# EAGLE schematic rld-mobile (EAGLE 9.6.2)

## Sheet 1 of 3: MCU
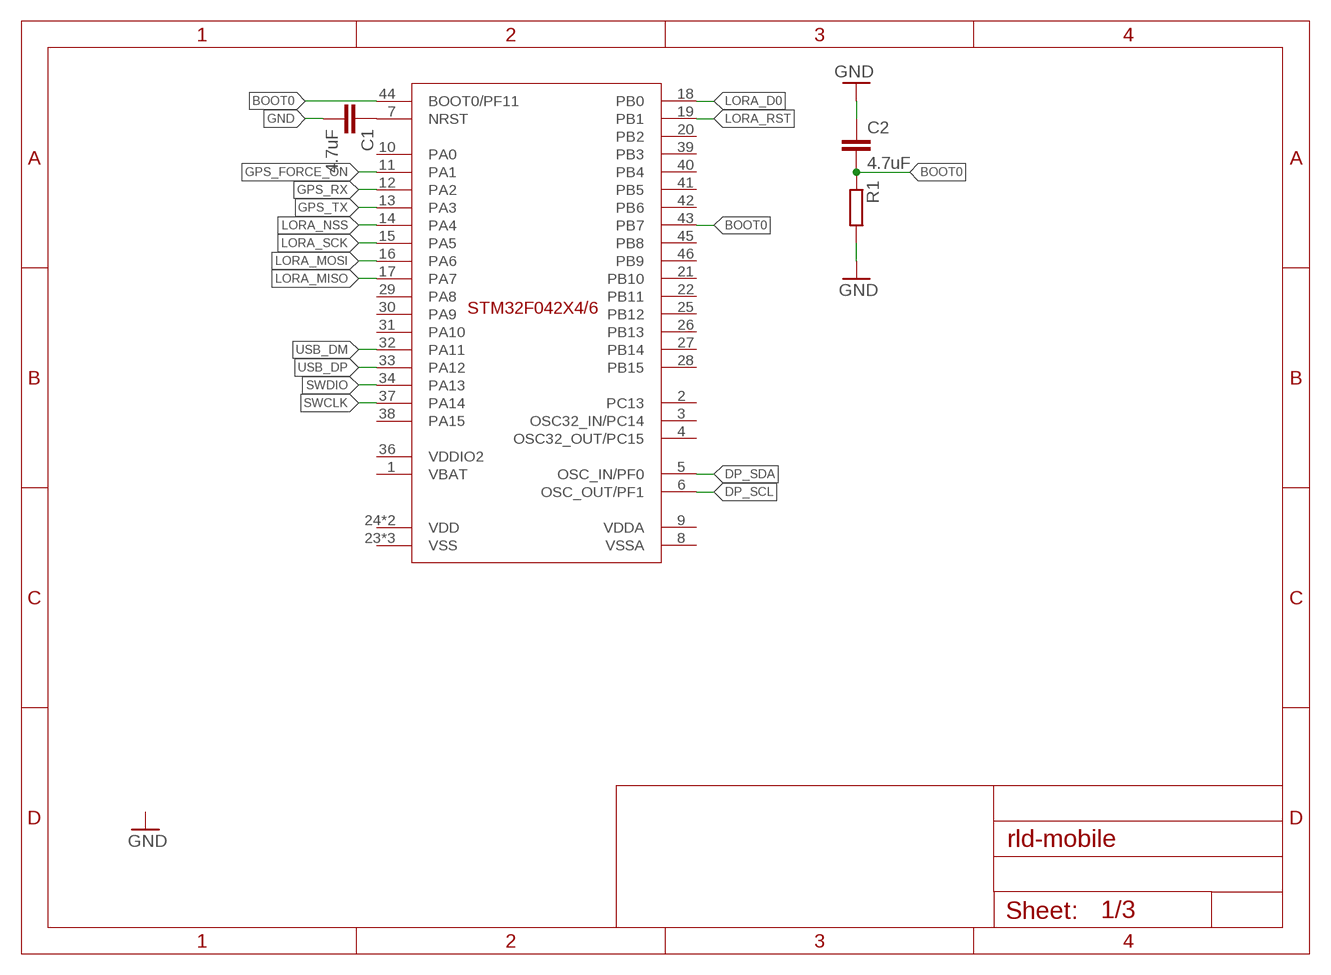
[diagram p0: schematic, sheet 1]

### Parts
C1  4.7uF  C-EUC0805  [C0805]
C2  4.7uF  C-EUC0805  [C0805]
R1  R-EU_R0805  [R0805]
U$1  STM32-F042X4/6-48  [UFQFPN48-7X7]

### Nets
BOOT0: C2.2 R1.1 U$1.43(PB7) U$1.44(BOOT0/PF11)
DP_SCL: U$1.6(OSC_OUT/PF1)
DP_SDA: U$1.5(OSC_IN/PF0)
GND: C1.2 C2.1 R1.2
GPS_FORCE_ON: U$1.11(PA1)
GPS_RX: U$1.12(PA2)
GPS_TX: U$1.13(PA3)
LORA_D0: U$1.18(PB0)
LORA_MISO: U$1.17(PA7)
LORA_MOSI: U$1.16(PA6)
LORA_NSS: U$1.14(PA4)
LORA_RST: U$1.19(PB1)
LORA_SCK: U$1.15(PA5)
N$2: C1.1 U$1.7(NRST)
SWCLK: U$1.37(PA14)
SWDIO: U$1.34(PA13)
USB_DM: U$1.32(PA11)
USB_DP: U$1.33(PA12)
Unconnected: U$1.1(VBAT) U$1.2(PC13) U$1.3(OSC32_IN/PC14) U$1.4(OSC32_OUT/PC15) U$1.8(VSSA) U$1.9(VDDA) U$1.10(PA0) U$1.20(PB2) U$1.21(PB10) U$1.22(PB11) U$1.23(VSS) U$1.24(VDD) U$1.25(PB12) U$1.26(PB13) U$1.27(PB14) U$1.28(PB15) U$1.29(PA8) U$1.30(PA9) U$1.31(PA10) U$1.35(VSS) U$1.36(VDDIO2) U$1.38(PA15) U$1.39(PB3) U$1.40(PB4) U$1.41(PB5) U$1.42(PB6) U$1.45(PB8) U$1.46(PB9) U$1.47(VSS) U$1.48(VDD)

## Sheet 2 of 3: Power supply
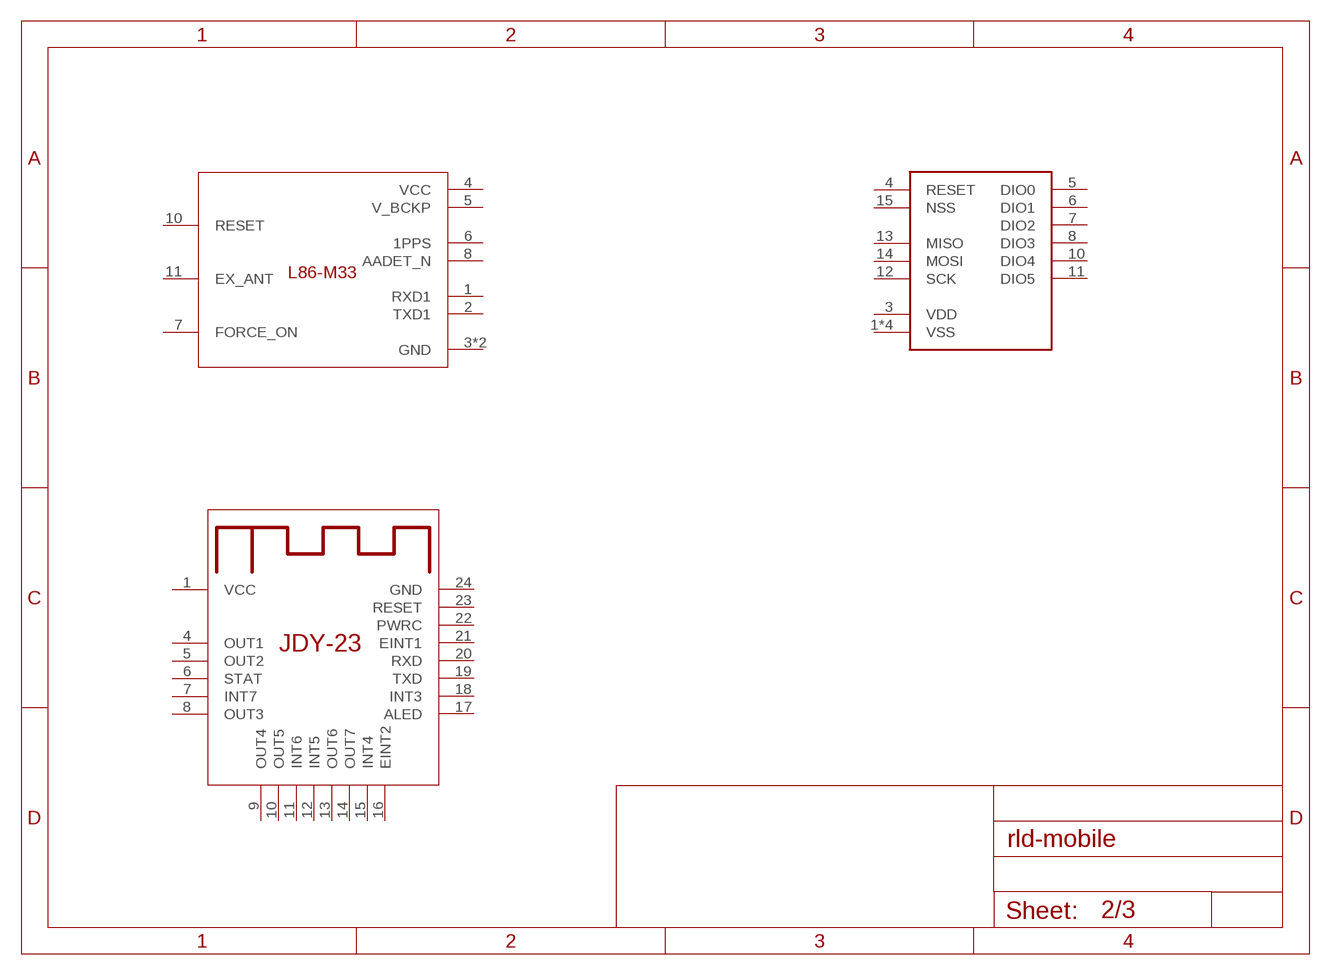
[diagram p1: schematic, sheet 2]

### Parts
U$3  RA-02  [RA-01/RA-02]
U$4  L86-M33  [L86-M33]
U$5  JDY-23  [JDY-23]
Unconnected: U$3.1(VSS) U$3.2(VSS) U$3.3(VDD) U$3.4(RESET) U$3.5(DIO0) U$3.6(DIO1) U$3.7(DIO2) U$3.8(DIO3) U$3.9(VSS) U$3.10(DIO4) U$3.11(DIO5) U$3.12(SCK) U$3.13(MISO) U$3.14(MOSI) U$3.15(NSS) U$3.16(VSS) U$4.1(RXD1) U$4.2(TXD1) U$4.3(GND) U$4.4(VCC) U$4.5(V_BCKP) U$4.6(1PPS) U$4.7(FORCE_ON) U$4.8(AADET_N) U$4.10(RESET) U$4.11(EX_ANT) U$4.12(GND) U$5.1(VCC) U$5.4(OUT1) U$5.5(OUT2) U$5.6(STAT) U$5.7(INT7) U$5.8(OUT3) U$5.9(OUT4) U$5.10(OUT5) U$5.11(INT6) U$5.12(INT5) U$5.13(OUT6) U$5.14(OUT7) U$5.15(INT4) U$5.16(EINT2) U$5.17(ALED) U$5.18(INT3) U$5.19(TXD) U$5.20(RXD) U$5.21(EINT1) U$5.22(PWRC) U$5.23(RESET) U$5.24(GND)

## Sheet 3 of 3
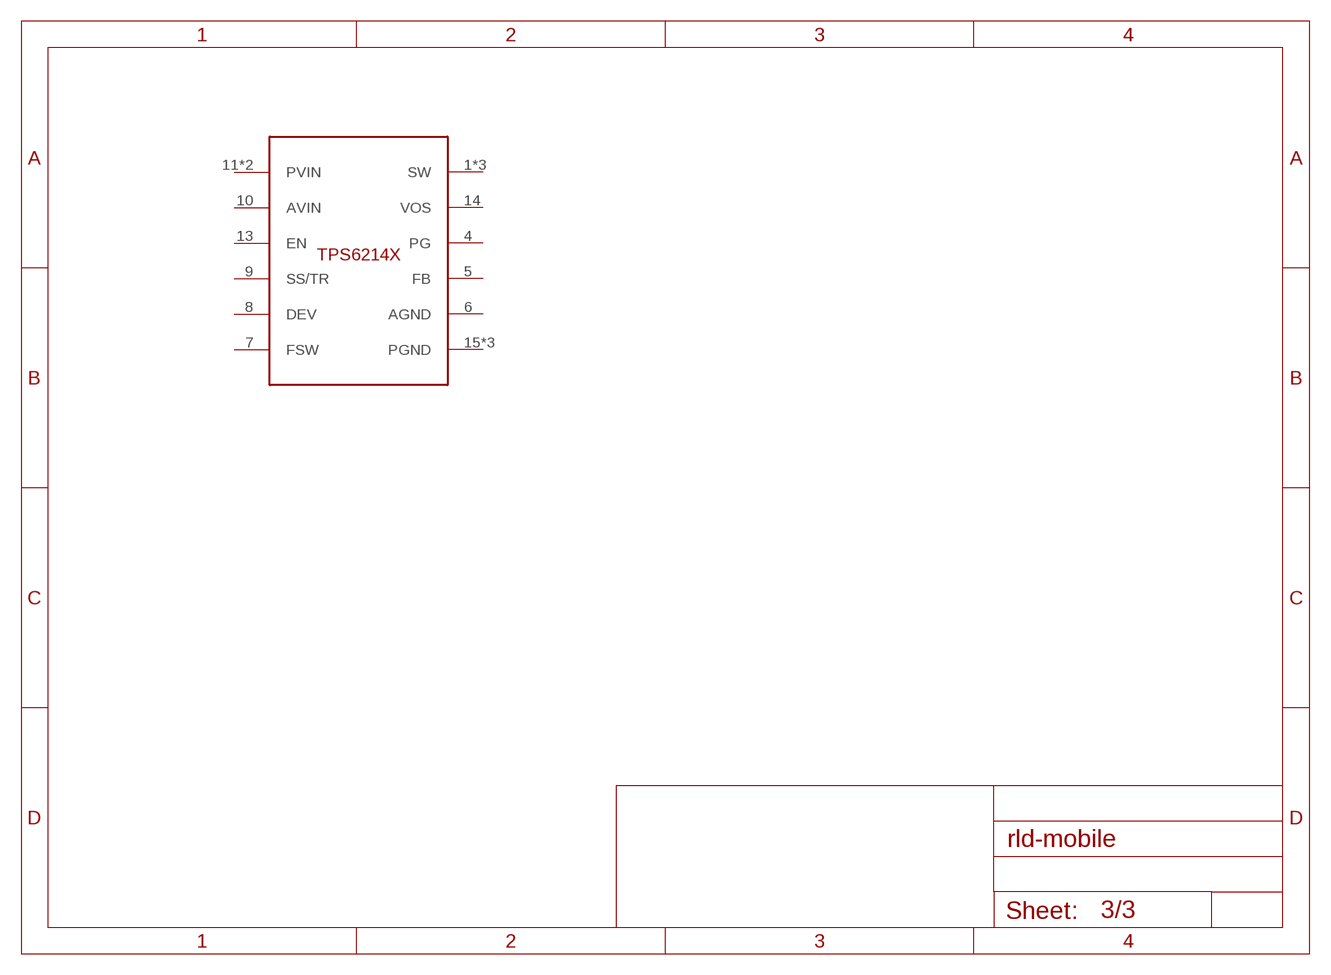
[diagram p2: schematic, sheet 3]

### Parts
U$2  TPS6214X  [VQFN16-3X3]
Unconnected: U$2.1(SW) U$2.2(SW) U$2.3(SW) U$2.4(PG) U$2.5(FB) U$2.6(AGND) U$2.7(FSW) U$2.8(DEV) U$2.9(SS/TR) U$2.10(AVIN) U$2.11(PVIN) U$2.12(PVIN) U$2.13(EN) U$2.14(VOS) U$2.15(PGND) U$2.16(PGND) U$2.17(PGND)

## Library data of the parts
C1 C2 = rcl:C-EU: CAPACITOR, European symbol; SPICEPREFIX: C
R1 = rcl:R-EU_: RESISTOR, European symbol; SPICEPREFIX: R
U$1 = st-microelectronics:STM32-F042X4/6-48
U$2 = texas-instruments:TPS6214X
U$3 = ai-thinker:RA-02
U$4 = quectel:L86-M33
U$5 = bluetooth:JDY-23